# Altium project TPM 2.0 PCB.PrjPcb
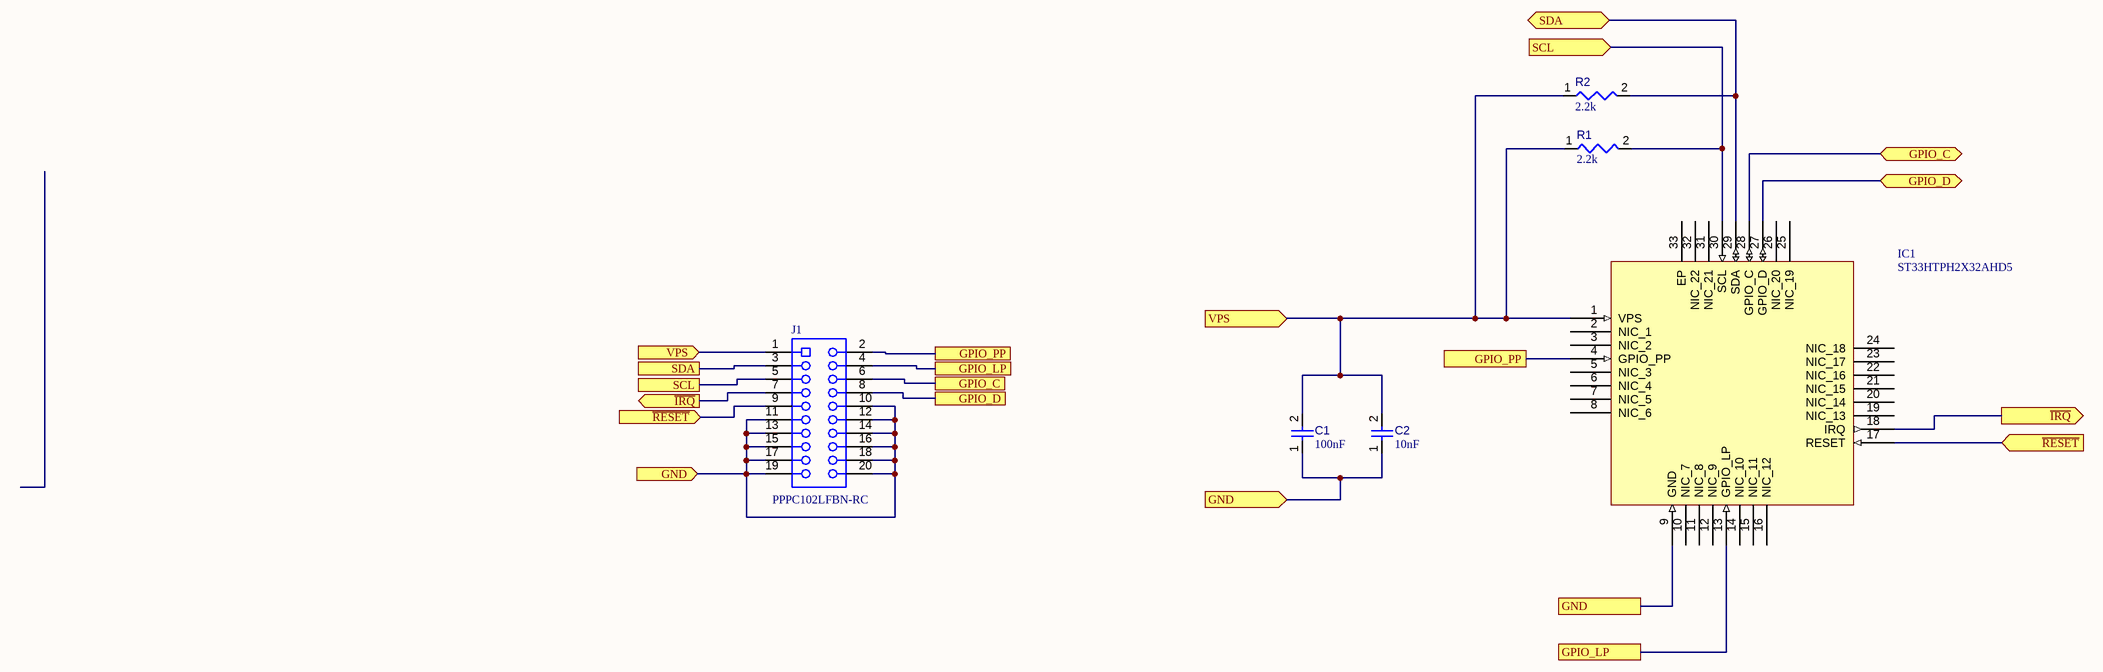
[diagram p0: Sheet1.SchDoc]
CAGE_CODE: ?????; CONTRACT_NUMBER: <CONTRACT NO>; DOC_NO_ASSY_DWG: <ASSY DWG NO>; DOC_NO_BOM: <BOM DOC NO>; DOC_NO_FAB_DWG: <FAB DWG NO>; DOC_NO_SCH_DWG: <SCH DWG NO>; PCB_2_DEC_TOL: +/-.01; PCB_3_DEC_TOL: +/-.010; PCB_ANG_TOL: +/-1/2; PCB_ASSEMBLY_NO: <PCB ASSY NO>; PCB_CHECKER: - -----; PCB_CHECKER_APP_DATE: --/--/----; PCB_DESIGNER: - -----; PCB_DESIGNER_APP_DATE: --/--/----; PCB_DWG_NO: <PCB DWG NO>; PCB_ENGINEER: - -----; PCB_ENGINEER_APP_DATE: --/--/----; PCB_PART_NUMBER: <PCB PN>; PCB_REV: A; SCH_REV: A
1 sheet, 6 parts. Net scope: flat (ports and power ports of the same name join across sheets).
Board file: PCB1.PcbDoc

## Sheet Sheet1.SchDoc
size 431 x 279 mm; SheetNumber: 1; SheetTotal: 1; ENG_APP_DATE: --/--/--; DSN_APP_DATE: --/--/--; CHK_APP_DATE: --/--/--

### Parts
C1  value 100nF  [CAPC0402(1005)60_L]  (hidden comment: Capacitor 100nF +/-20% 10V 0402)
C2  value 10nF  [CAPC0402(1005)60_L]  (hidden comment: Capacitor 10nF +/-20% 50V 0402)
IC1  ST33HTPH2X32AHD5  [QFN50P500X500X100-33N-D]
J1  PPPC102LFBN-RC  [SLIN-PPPC102LFBN-RC_V]
R1  value 2.2k  [RESC0402(1005)_L]  (hidden comment: Resistor 2K2  +/-5 % 0402 63 mW)
R2  value 2.2k  [RESC0402(1005)_L]  (hidden comment: Resistor 2K2  +/-5 % 0402 63 mW)

### Ports
GND, GND (in), GPIO_C, GPIO_C (bidir), GPIO_D, GPIO_D (bidir), GPIO_LP, GPIO_PP, SCL, SCL (in), SDA, SDA (bidir), VPS (in), ~{IRQ} (out), ~{RESET} (in)

### Nets
NetC1_1: C1.1 C2.1 IC1.9(GND) J1.10 J1.11 J1.12 J1.13 J1.14 J1.15 J1.16 J1.17 J1.18 J1.19 J1.20 ; port GND
NetC1_2: C1.2 C2.2 IC1.1(VPS) J1.1 R1.1 R2.1 ; port VPS
NetIC1_4: IC1.4(GPIO_PP) J1.2 ; port GPIO_PP
NetIC1_13: IC1.13(GPIO_LP) J1.4 ; port GPIO_LP
NetIC1_17: IC1.17(RESET) J1.9 ; port ~{RESET}
NetIC1_18: IC1.18(IRQ) J1.7 ; port ~{IRQ}
NetIC1_27: IC1.27(GPIO_D) J1.8 ; port GPIO_D
NetIC1_28: IC1.28(GPIO_C) J1.6 ; port GPIO_C
NetIC1_29: IC1.29(SDA) J1.3 R2.2 ; port SDA
NetIC1_30: IC1.30(SCL) J1.5 R1.2 ; port SCL

Not connected (* = marked no-connect by the designer): IC1 2(NIC_1) 3(NIC_2) 5(NIC_3) 6(NIC_4) 7(NIC_5) 8(NIC_6) 10(NIC_7) 11(NIC_8) 12(NIC_9) 14(NIC_10) 15(NIC_11) 16(NIC_12) 19(NIC_13) 20(NIC_14) 21(NIC_15) 22(NIC_16) 23(NIC_17) 24(NIC_18) 25(NIC_19) 26(NIC_20) 31(NIC_21) 32(NIC_22) 33(EP)

### Notes on the sheet
- DWG. NO.
- REV.
- SHT.
- THIS DOCUMENT AND THE DATA DISCLOSED HEREIN OR HEREWITH IS THE PROPERTY OF ALTIUM LIMITED AND MAY BE FREELY DISTRIBUTED IN WHOLE. NO RIGHTS ARE RESERVED OR EXPRESS OR IMPLIED WARANTEE GIVEN.
- REVISION
- DESCRIPTION
- DATE
- APPROVED
- ENG:
- APPROVALS
- PROJECT
- DSN:
- CHK:
- REFERENCE DOCUMENTS
- PROJECT REVISION:
- TITLE
- DOCUMENT REVISION:
- DESIGN ITEM:
- BOM:
- FAB DWG:
- PCB DWG:
- ASSY DWG:
- SCALE:
- SIZE
- B
- CAGE CODE
- FILE NAME
- DWG NO.
- SHEET
- OF
- REV

### Library data of the parts
C1 = CMP-001-00061-3: Chip Capacitor, 100nF +/-20%, 10V, 0402, Thickness 0.6 mm; Tolerance: 20%; Mounting Technology: SMT; Voltage Rating: 10V; Max Operating Temperature: 85°C; Pins: 2; Case/Package: 0402; Min Operating Temperature: -55°C
C2 = CMP-001-00069-3: Chip Capacitor, 10nF +/-20%, 50V, 0402, Thickness 0.6 mm; Tolerance: 5%; Max Operating Temperature: 85°C; Pins: 2; Case/Package: 0402; Voltage Rating: 50V; Min Operating Temperature: -55°C; Mounting Technology: SMT
IC1 = CMP-020-00025-2: Microprocessor Circuit - Long-term evolution TPM 2.0 device with an I2C interface; Min Supply Voltage: -300mV; I/Os: 4; Nominal Supply Voltage: 3.3V; Max Supply Voltage: 3.6V; Interface: I2C; RoHS Compliant: Yes; Pins: 33; Min Operating Temperature: -25°C; Max Operating Temperature: 85°C; Case/Package: VFQFPN32 ECOPACK2
J1 = CMP-002-00029-2: Female Header, Pitch 2.54 mm, 2 x 10 Position, Height 8.75 mm, Tail Length 3.2 mm, -40 to 105 degC, RoHS, Bulk; Manufacturer: Sullins; Mounting Technology: TH; RoHS Compliant: Unknown; Gender: Female; Case/Package: PPPC102LFBN-RC; Min Operating Temperature: -40°C; Datasheet Version: Rev. D, 10/2007; Max Operating Temperature: 105°C; Package Description: Female Header, Pitch 2.54 mm, 2 x 10 Position, Height 8.75 mm, Tail Length 3.2 mm; Package Reference: PPPC102LFBN-RC; Connector Type: Header; Datasheet URL: http://datasheet.octopart.com/PPPC102LFBN-RC-Sullins-datasheet-8327184.pdf
R1 R2 = CMP-009-00166-3: Chip Resistor, 2,2 kOhms, +/-5 %, 63 mW, -55 to 155 degC, 0402; Power: 63mW; Tolerance: 5%; Pins: 2; Min Operating Temperature: -55°C; Max Operating Temperature: 155°C; Case/Package: 0402